# EAGLE schematic OPBS-Muscle (EAGLE 6.4)

## Sheet 1 of 7
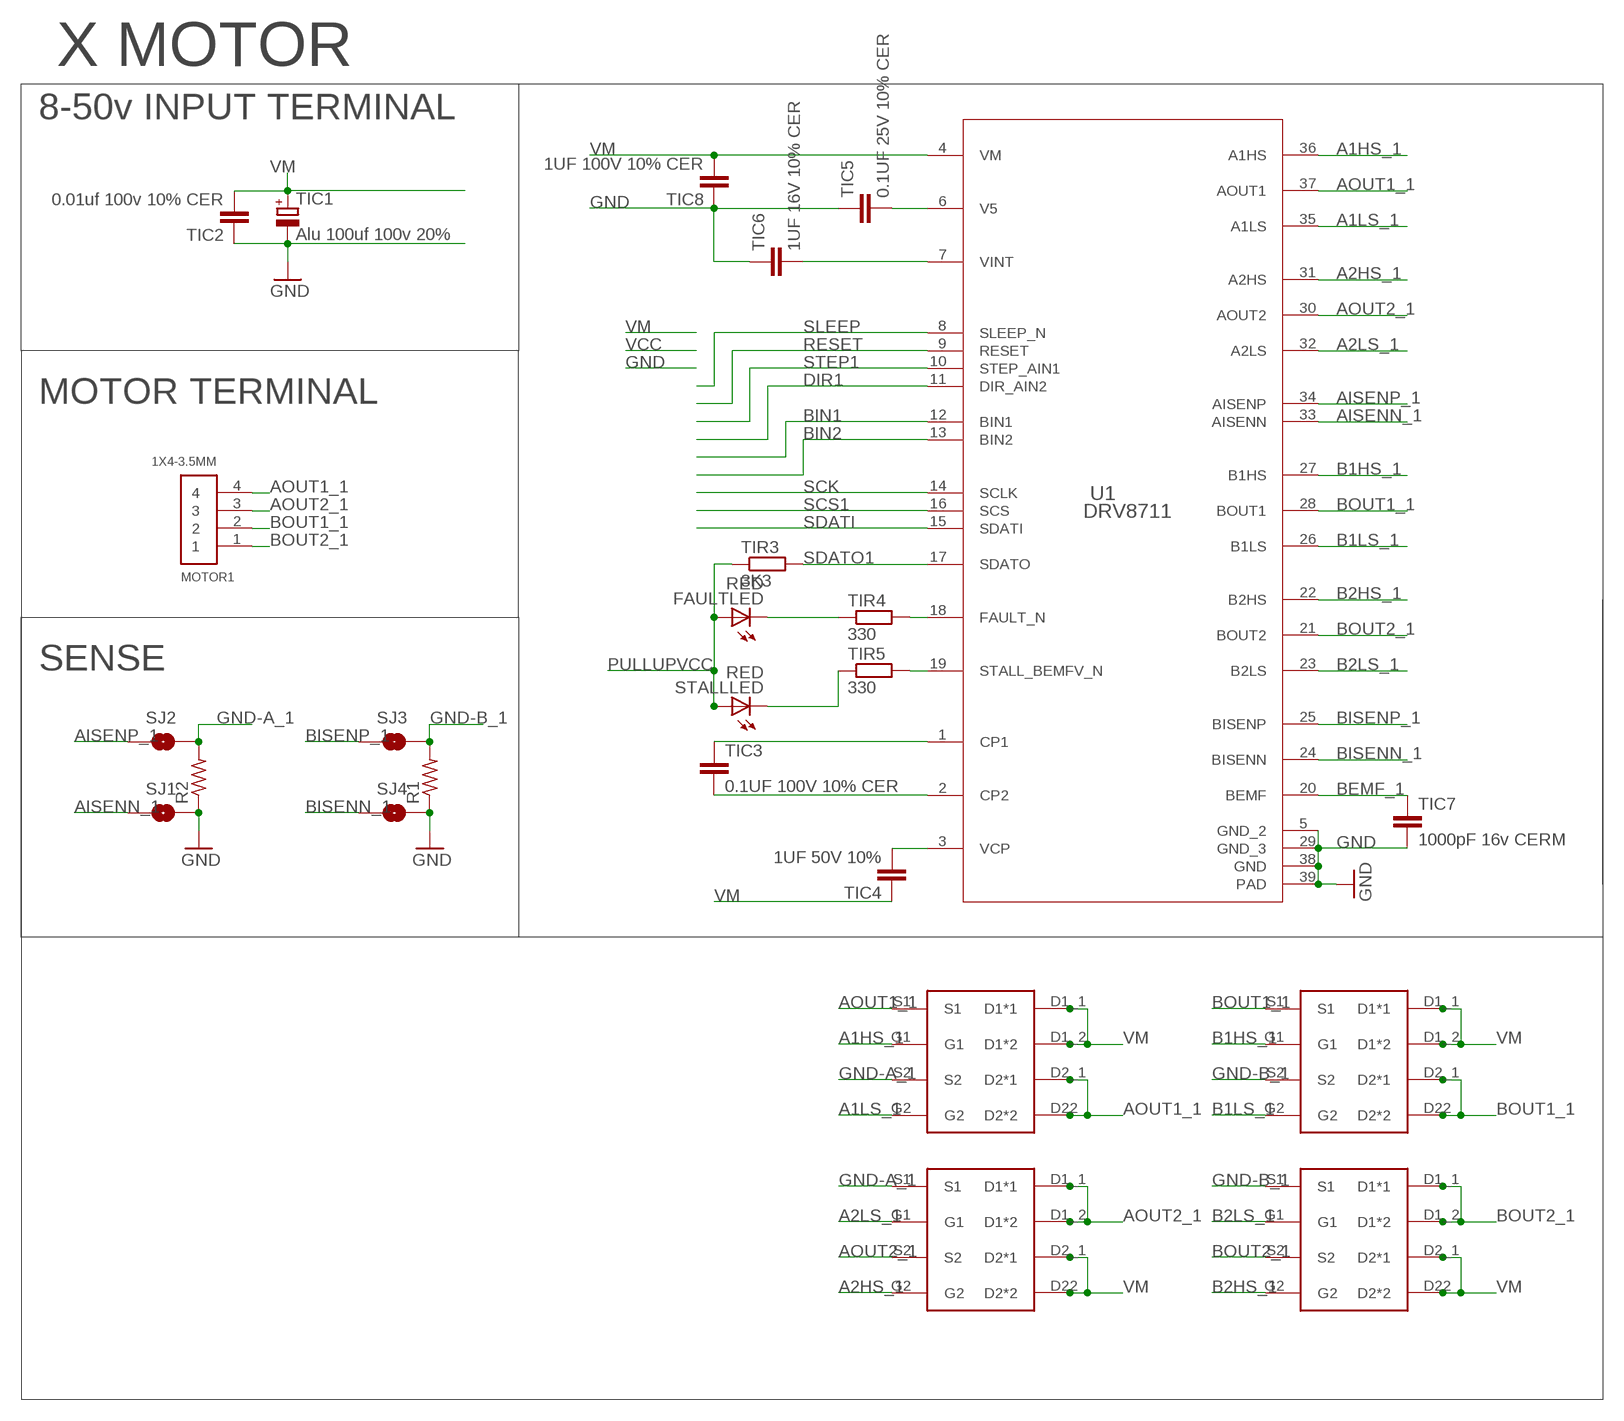
[diagram p0: schematic, sheet 1]

### Parts
FAULTLED  RED  LEDSMT1206  [1206]
MOTOR1  1X4-3.5MM  [1X04-3.5MM]
R1  R-US_R2512  [R2512]
R2  R-US_R2512  [R2512]
SJ1  SOLDERJUMPERTRACE  [SJ_2S-TRACE]
SJ2  SOLDERJUMPERTRACE  [SJ_2S-TRACE]
SJ3  SOLDERJUMPERTRACE  [SJ_2S-TRACE]
SJ4  SOLDERJUMPERTRACE  [SJ_2S-TRACE]
STALLLED  RED  LEDSMT1206  [1206]
TIC1  Alu 100uf 100v 20%  CPOL-EUE5-10.5  [E5-10,5]
TIC2  0.01uf 100v 10% CER  C-EUC0603K  [C0603K]
TIC3  0.1UF 100V 10% CER  C-EUC0603K  [C0603K]
TIC4  1UF 50V 10%  C-EUC0805K  [C0805K]
TIC5  0.1UF 25V 10% CER  C-EUC0603K  [C0603K]
TIC6  1UF 16V 10% CER  C-EUC0603K  [C0603K]
TIC7  1000pF 16v CERM  C-EUC0603K  [C0603K]
TIC8  1UF 100V 10% CER  C-EUC1206K  [C1206K]
TIR3  3K3  R-EU_R1206  [R1206]
TIR4  330  R-EU_R1206  [R1206]
TIR5  330  R-EU_R1206  [R1206]
U1  DRV8711  DRV8711DCPR  [DCP0038A_N]
U$1  CSD88537ND  [CSD88537ND]
U$2  CSD88537ND  [CSD88537ND]
U$3  CSD88537ND  [CSD88537ND]
U$4  CSD88537ND  [CSD88537ND]

### Nets
A1HS_1: U1.36(A1HS) U$1.G1
A1LS_1: U1.35(A1LS) U$1.G2
A2HS_1: U1.31(A2HS) U$3.G2
A2LS_1: U1.32(A2LS) U$3.G1
AISENN_1: SJ1.1 U1.33(AISENN)
AISENP_1: SJ2.1 U1.34(AISENP)
AOUT1_1: MOTOR1.4 U1.37(AOUT1) U$1.D2_1(D2*1) U$1.D22(D2*2) U$1.S1
AOUT2_1: MOTOR1.3 U1.30(AOUT2) U$3.D1_1(D1*1) U$3.D1_2(D1*2) U$3.S2
B1HS_1: U1.27(B1HS) U$2.G1
B1LS_1: U1.26(B1LS) U$2.G2
B2HS_1: U1.22(B2HS) U$4.G2
B2LS_1: U1.23(B2LS) U$4.G1
BEMF_1: TIC7.1 U1.20(BEMF)
BIN1: U1.12(BIN1)
BIN2: U1.13(BIN2)
BISENN_1: SJ4.1 U1.24(BISENN)
BISENP_1: SJ3.1 U1.25(BISENP)
BOUT1_1: MOTOR1.2 U1.28(BOUT1) U$2.D2_1(D2*1) U$2.D22(D2*2) U$2.S1
BOUT2_1: MOTOR1.1 U1.21(BOUT2) U$4.D1_1(D1*1) U$4.D1_2(D1*2) U$4.S2
CP1_1: TIC3.1 U1.1(CP1)
CP2_1: TIC3.2 U1.2(CP2)
DIR1: U1.11(DIR_AIN2) ; also sheet 6
FAULT_N1: TIR4.2 U1.18(FAULT_N)
FAULTLED: FAULTLED.C TIR4.1
GND: R1.1 R2.1 SJ1.2 SJ4.2 TIC1.- TIC2.1 TIC5.1 TIC6.1 TIC7.2 TIC8.1 U1.5(GND_2) U1.29(GND_3) U1.38(GND) U1.39(PAD) ; also sheet 2,3,4,5,6,7
GND-A_1: R2.2 SJ2.2 U$1.S2 U$3.S1
GND-B_1: R1.2 SJ3.2 U$2.S2 U$4.S1
PULLUPVCC: FAULTLED.A STALLLED.A TIR3.1 ; also sheet 2,3,4,6
RESET: U1.9(RESET) ; also sheet 2,3,4,6
SCK: U1.14(SCLK) ; also sheet 2,3,4,6
SCS1: U1.16(SCS) ; also sheet 6
SDATI: U1.15(SDATI) ; also sheet 2,3,4,6
SDATO1: TIR3.2 U1.17(SDATO) ; also sheet 2,3,4,6
SLEEP: U1.8(SLEEP_N) ; also sheet 2,3,4,6
STALL_N1: TIR5.2 U1.19(STALL_BEMFV_N)
STALLLED: STALLLED.C TIR5.1
STEP1: U1.10(STEP_AIN1) ; also sheet 6
V5_1: TIC5.2 U1.6(V5)
VCP1: TIC4.2 U1.3(VCP)
VINT1: TIC6.2 U1.7(VINT)
VM: TIC1.+ TIC2.2 TIC4.1 TIC8.2 U1.4(VM) U$1.D1_1(D1*1) U$1.D1_2(D1*2) U$2.D1_1(D1*1) U$2.D1_2(D1*2) U$3.D2_1(D2*1) U$3.D22(D2*2) U$4.D2_1(D2*1) U$4.D22(D2*2) ; also sheet 2,3,4,5,6,7

### Notes on the sheet
- X MOTOR
- 8-50v INPUT TERMINAL
- MOTOR TERMINAL
- SENSE

## Sheet 2 of 7
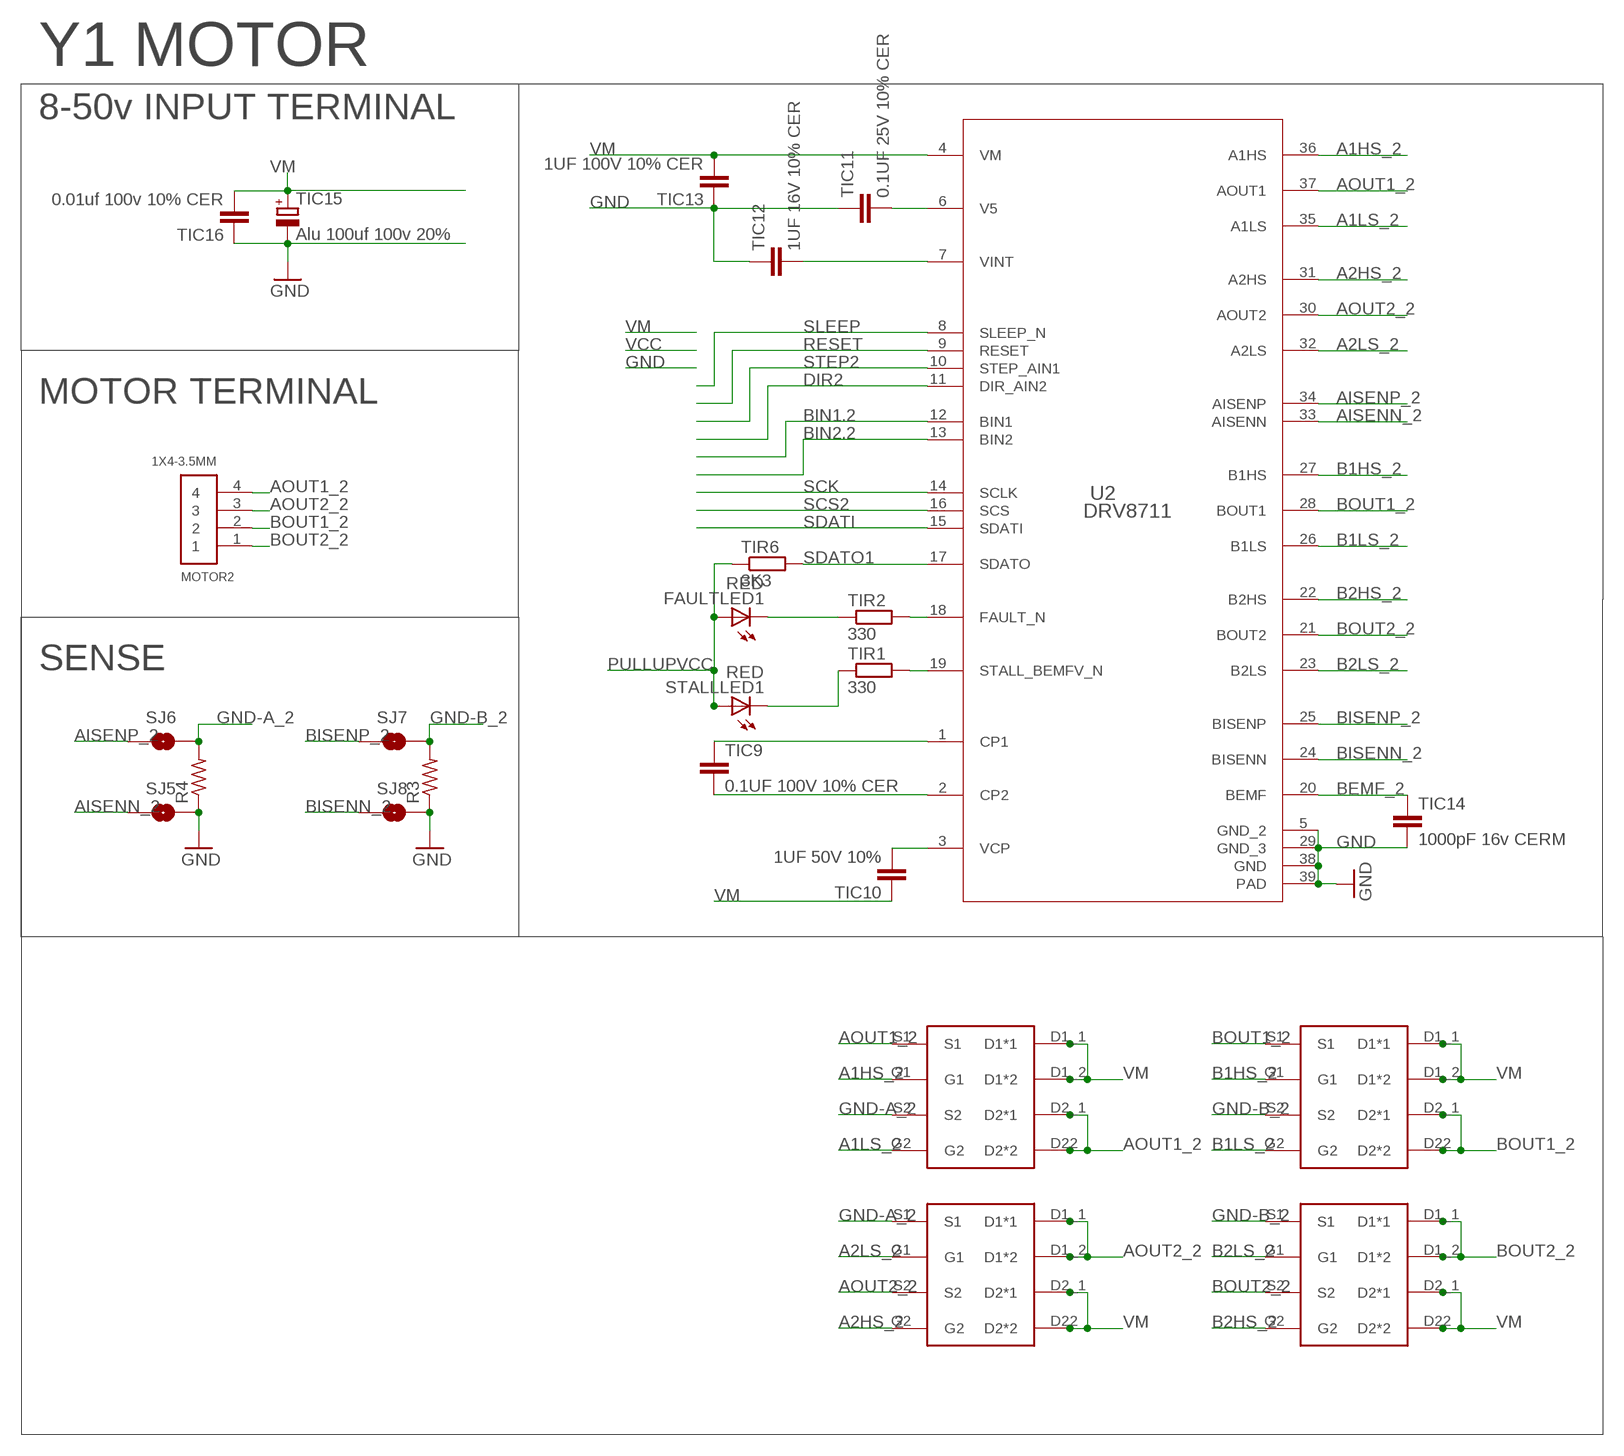
[diagram p1: schematic, sheet 2]

### Parts
FAULTLED1  RED  LEDSMT1206  [1206]
MOTOR2  1X4-3.5MM  [1X04-3.5MM]
R3  R-US_R2512  [R2512]
R4  R-US_R2512  [R2512]
SJ5  SOLDERJUMPERTRACE  [SJ_2S-TRACE]
SJ6  SOLDERJUMPERTRACE  [SJ_2S-TRACE]
SJ7  SOLDERJUMPERTRACE  [SJ_2S-TRACE]
SJ8  SOLDERJUMPERTRACE  [SJ_2S-TRACE]
STALLLED1  RED  LEDSMT1206  [1206]
TIC9  0.1UF 100V 10% CER  C-EUC0603K  [C0603K]
TIC10  1UF 50V 10%  C-EUC0805K  [C0805K]
TIC11  0.1UF 25V 10% CER  C-EUC0603K  [C0603K]
TIC12  1UF 16V 10% CER  C-EUC0603K  [C0603K]
TIC13  1UF 100V 10% CER  C-EUC1206K  [C1206K]
TIC14  1000pF 16v CERM  C-EUC0603K  [C0603K]
TIC15  Alu 100uf 100v 20%  CPOL-EUE5-10.5  [E5-10,5]
TIC16  0.01uf 100v 10% CER  C-EUC0603K  [C0603K]
TIR1  330  R-EU_R1206  [R1206]
TIR2  330  R-EU_R1206  [R1206]
TIR6  3K3  R-EU_R1206  [R1206]
U2  DRV8711  DRV8711DCPR  [DCP0038A_N]
U$5  CSD88537ND  [CSD88537ND]
U$6  CSD88537ND  [CSD88537ND]
U$7  CSD88537ND  [CSD88537ND]
U$8  CSD88537ND  [CSD88537ND]

### Nets
A1HS_2: U2.36(A1HS) U$5.G1
A1LS_2: U2.35(A1LS) U$5.G2
A2HS_2: U2.31(A2HS) U$7.G2
A2LS_2: U2.32(A2LS) U$7.G1
AISENN_2: SJ5.1 U2.33(AISENN)
AISENP_2: SJ6.1 U2.34(AISENP)
AOUT1_2: MOTOR2.4 U2.37(AOUT1) U$5.D2_1(D2*1) U$5.D22(D2*2) U$5.S1
AOUT2_2: MOTOR2.3 U2.30(AOUT2) U$7.D1_1(D1*1) U$7.D1_2(D1*2) U$7.S2
B1HS_2: U2.27(B1HS) U$6.G1
B1LS_2: U2.26(B1LS) U$6.G2
B2HS_2: U2.22(B2HS) U$8.G2
B2LS_2: U2.23(B2LS) U$8.G1
BEMF_2: TIC14.1 U2.20(BEMF)
BIN1.2: U2.12(BIN1)
BIN2.2: U2.13(BIN2)
BISENN_2: SJ8.1 U2.24(BISENN)
BISENP_2: SJ7.1 U2.25(BISENP)
BOUT1_2: MOTOR2.2 U2.28(BOUT1) U$6.D2_1(D2*1) U$6.D22(D2*2) U$6.S1
BOUT2_2: MOTOR2.1 U2.21(BOUT2) U$8.D1_1(D1*1) U$8.D1_2(D1*2) U$8.S2
CP1_2: TIC9.1 U2.1(CP1)
CP2_2: TIC9.2 U2.2(CP2)
DIR2: U2.11(DIR_AIN2) ; also sheet 6
FAULT_N2: TIR2.2 U2.18(FAULT_N)
FAULTLED2: FAULTLED1.C TIR2.1
GND: R3.1 R4.1 SJ5.2 SJ8.2 TIC11.1 TIC12.1 TIC13.1 TIC14.2 TIC15.- TIC16.1 U2.5(GND_2) U2.29(GND_3) U2.38(GND) U2.39(PAD) ; also sheet 1,3,4,5,6,7
GND-A_2: R4.2 SJ6.2 U$5.S2 U$7.S1
GND-B_2: R3.2 SJ7.2 U$6.S2 U$8.S1
PULLUPVCC: FAULTLED1.A STALLLED1.A TIR6.1 ; also sheet 1,3,4,6
RESET: U2.9(RESET) ; also sheet 1,3,4,6
SCK: U2.14(SCLK) ; also sheet 1,3,4,6
SCS2: U2.16(SCS) ; also sheet 6
SDATI: U2.15(SDATI) ; also sheet 1,3,4,6
SDATO1: TIR6.2 U2.17(SDATO) ; also sheet 1,3,4,6
SLEEP: U2.8(SLEEP_N) ; also sheet 1,3,4,6
STALL_N2: TIR1.2 U2.19(STALL_BEMFV_N)
STALLLED2: STALLLED1.C TIR1.1
STEP2: U2.10(STEP_AIN1) ; also sheet 6
V5_2: TIC11.2 U2.6(V5)
VCP2: TIC10.2 U2.3(VCP)
VINT2: TIC12.2 U2.7(VINT)
VM: TIC10.1 TIC13.2 TIC15.+ TIC16.2 U2.4(VM) U$5.D1_1(D1*1) U$5.D1_2(D1*2) U$6.D1_1(D1*1) U$6.D1_2(D1*2) U$7.D2_1(D2*1) U$7.D22(D2*2) U$8.D2_1(D2*1) U$8.D22(D2*2) ; also sheet 1,3,4,5,6,7

### Notes on the sheet
- Y1 MOTOR
- 8-50v INPUT TERMINAL
- MOTOR TERMINAL
- SENSE

## Sheet 3 of 7
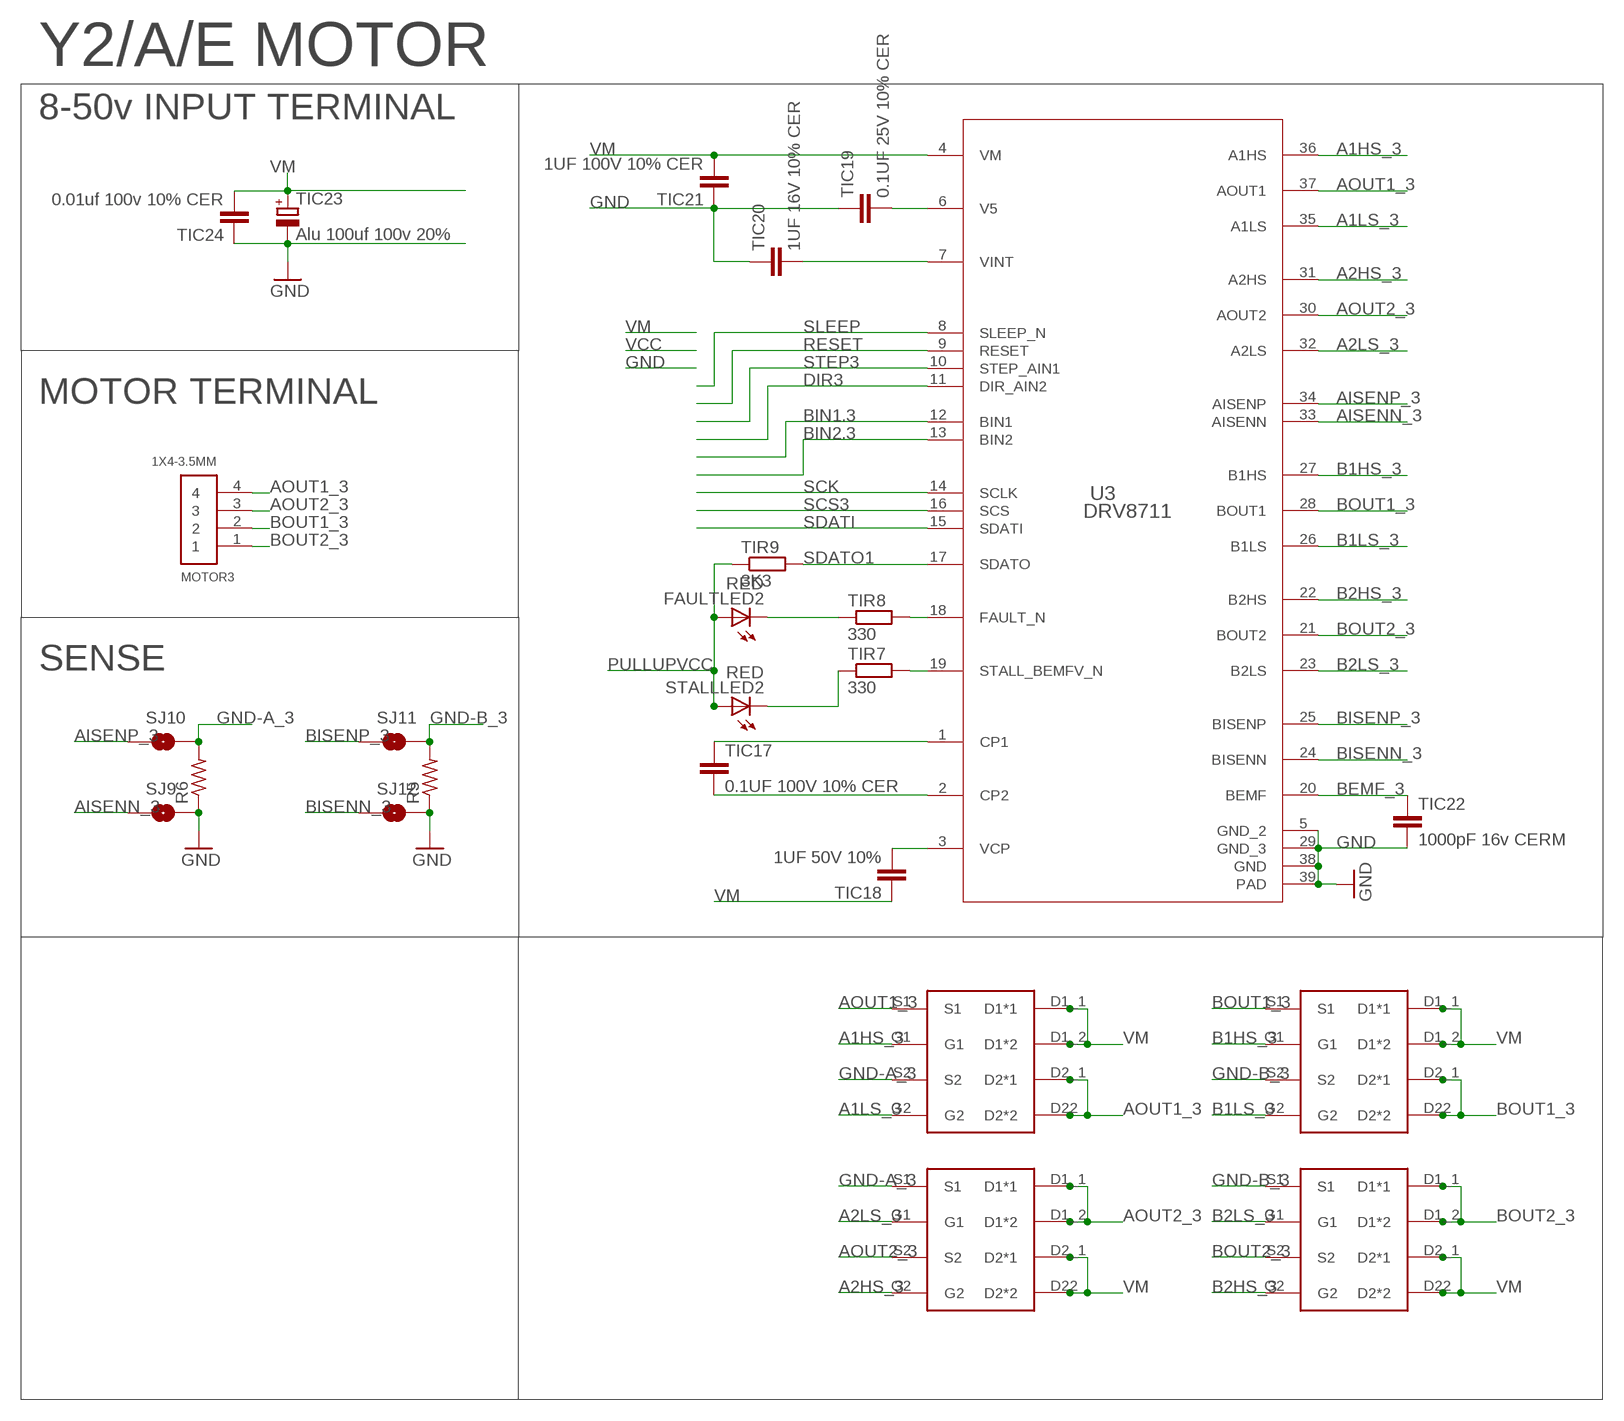
[diagram p2: schematic, sheet 3]

### Parts
FAULTLED2  RED  LEDSMT1206  [1206]
MOTOR3  1X4-3.5MM  [1X04-3.5MM]
R5  R-US_R2512  [R2512]
R6  R-US_R2512  [R2512]
SJ9  SOLDERJUMPERTRACE  [SJ_2S-TRACE]
SJ10  SOLDERJUMPERTRACE  [SJ_2S-TRACE]
SJ11  SOLDERJUMPERTRACE  [SJ_2S-TRACE]
SJ12  SOLDERJUMPERTRACE  [SJ_2S-TRACE]
STALLLED2  RED  LEDSMT1206  [1206]
TIC17  0.1UF 100V 10% CER  C-EUC0603K  [C0603K]
TIC18  1UF 50V 10%  C-EUC0805K  [C0805K]
TIC19  0.1UF 25V 10% CER  C-EUC0603K  [C0603K]
TIC20  1UF 16V 10% CER  C-EUC0603K  [C0603K]
TIC21  1UF 100V 10% CER  C-EUC1206K  [C1206K]
TIC22  1000pF 16v CERM  C-EUC0603K  [C0603K]
TIC23  Alu 100uf 100v 20%  CPOL-EUE5-10.5  [E5-10,5]
TIC24  0.01uf 100v 10% CER  C-EUC0603K  [C0603K]
TIR7  330  R-EU_R1206  [R1206]
TIR8  330  R-EU_R1206  [R1206]
TIR9  3K3  R-EU_R1206  [R1206]
U3  DRV8711  DRV8711DCPR  [DCP0038A_N]
U$9  CSD88537ND  [CSD88537ND]
U$10  CSD88537ND  [CSD88537ND]
U$11  CSD88537ND  [CSD88537ND]
U$12  CSD88537ND  [CSD88537ND]

### Nets
A1HS_3: U3.36(A1HS) U$9.G1
A1LS_3: U3.35(A1LS) U$9.G2
A2HS_3: U3.31(A2HS) U$11.G2
A2LS_3: U3.32(A2LS) U$11.G1
AISENN_3: SJ9.1 U3.33(AISENN)
AISENP_3: SJ10.1 U3.34(AISENP)
AOUT1_3: MOTOR3.4 U3.37(AOUT1) U$9.D2_1(D2*1) U$9.D22(D2*2) U$9.S1
AOUT2_3: MOTOR3.3 U3.30(AOUT2) U$11.D1_1(D1*1) U$11.D1_2(D1*2) U$11.S2
B1HS_3: U3.27(B1HS) U$10.G1
B1LS_3: U3.26(B1LS) U$10.G2
B2HS_3: U3.22(B2HS) U$12.G2
B2LS_3: U3.23(B2LS) U$12.G1
BEMF_3: TIC22.1 U3.20(BEMF)
BIN1.3: U3.12(BIN1)
BIN2.3: U3.13(BIN2)
BISENN_3: SJ12.1 U3.24(BISENN)
BISENP_3: SJ11.1 U3.25(BISENP)
BOUT1_3: MOTOR3.2 U3.28(BOUT1) U$10.D2_1(D2*1) U$10.D22(D2*2) U$10.S1
BOUT2_3: MOTOR3.1 U3.21(BOUT2) U$12.D1_1(D1*1) U$12.D1_2(D1*2) U$12.S2
CP1_3: TIC17.1 U3.1(CP1)
CP2_3: TIC17.2 U3.2(CP2)
DIR3: U3.11(DIR_AIN2) ; also sheet 6
FAULT_N3: TIR8.2 U3.18(FAULT_N)
FAULTLED3: FAULTLED2.C TIR8.1
GND: R5.1 R6.1 SJ9.2 SJ12.2 TIC19.1 TIC20.1 TIC21.1 TIC22.2 TIC23.- TIC24.1 U3.5(GND_2) U3.29(GND_3) U3.38(GND) U3.39(PAD) ; also sheet 1,2,4,5,6,7
GND-A_3: R6.2 SJ10.2 U$9.S2 U$11.S1
GND-B_3: R5.2 SJ11.2 U$10.S2 U$12.S1
PULLUPVCC: FAULTLED2.A STALLLED2.A TIR9.1 ; also sheet 1,2,4,6
RESET: U3.9(RESET) ; also sheet 1,2,4,6
SCK: U3.14(SCLK) ; also sheet 1,2,4,6
SCS3: U3.16(SCS) ; also sheet 6
SDATI: U3.15(SDATI) ; also sheet 1,2,4,6
SDATO1: TIR9.2 U3.17(SDATO) ; also sheet 1,2,4,6
SLEEP: U3.8(SLEEP_N) ; also sheet 1,2,4,6
STALL_N3: TIR7.2 U3.19(STALL_BEMFV_N)
STALLLED3: STALLLED2.C TIR7.1
STEP3: U3.10(STEP_AIN1) ; also sheet 6
V5_3: TIC19.2 U3.6(V5)
VCP3: TIC18.2 U3.3(VCP)
VINT3: TIC20.2 U3.7(VINT)
VM: TIC18.1 TIC21.2 TIC23.+ TIC24.2 U3.4(VM) U$9.D1_1(D1*1) U$9.D1_2(D1*2) U$10.D1_1(D1*1) U$10.D1_2(D1*2) U$11.D2_1(D2*1) U$11.D22(D2*2) U$12.D2_1(D2*1) U$12.D22(D2*2) ; also sheet 1,2,4,5,6,7

### Notes on the sheet
- Y2/A/E MOTOR
- 8-50v INPUT TERMINAL
- MOTOR TERMINAL
- SENSE

## Sheet 4 of 7
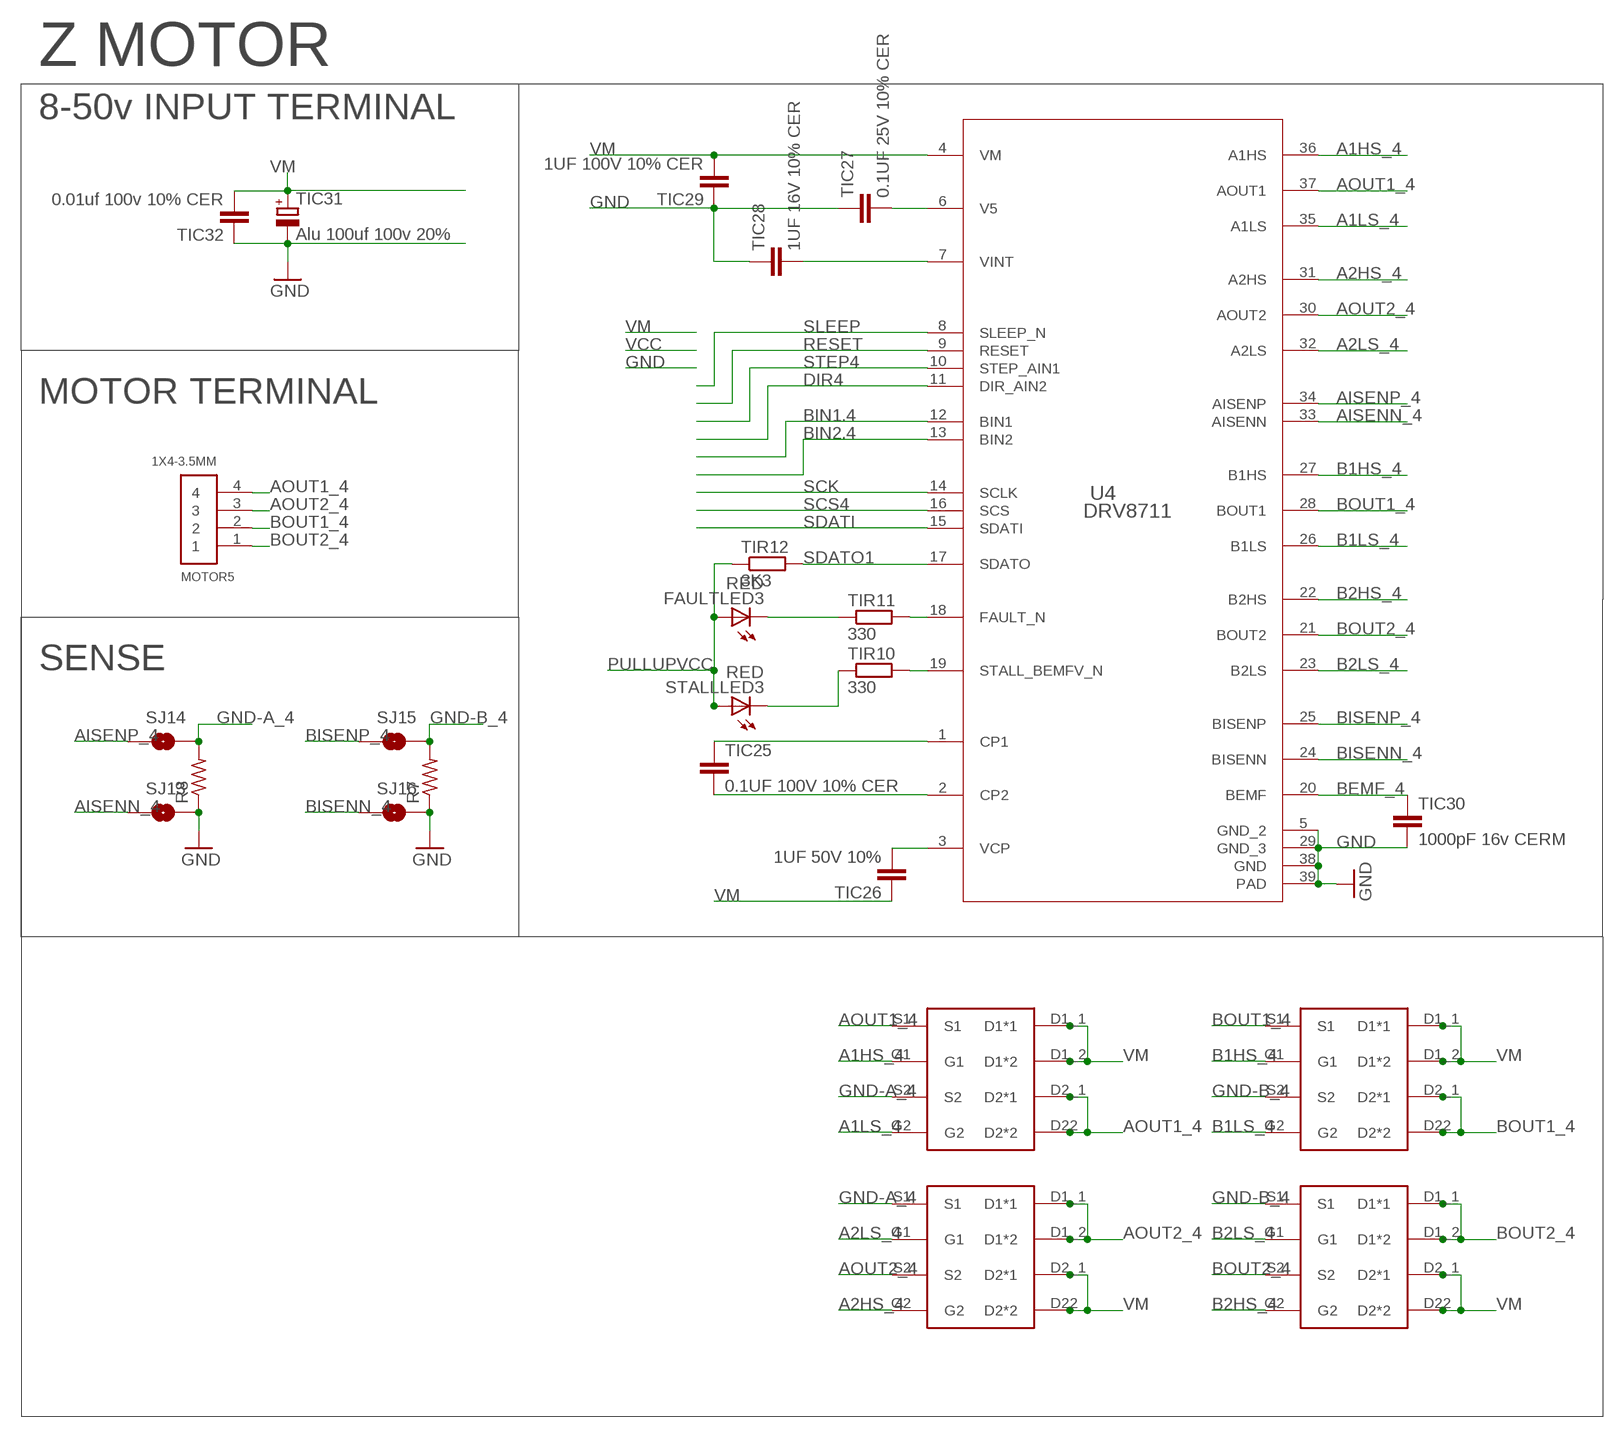
[diagram p3: schematic, sheet 4]

### Parts
FAULTLED3  RED  LEDSMT1206  [1206]
MOTOR5  1X4-3.5MM  [1X04-3.5MM]
R7  R-US_R2512  [R2512]
R8  R-US_R2512  [R2512]
SJ13  SOLDERJUMPERTRACE  [SJ_2S-TRACE]
SJ14  SOLDERJUMPERTRACE  [SJ_2S-TRACE]
SJ15  SOLDERJUMPERTRACE  [SJ_2S-TRACE]
SJ16  SOLDERJUMPERTRACE  [SJ_2S-TRACE]
STALLLED3  RED  LEDSMT1206  [1206]
TIC25  0.1UF 100V 10% CER  C-EUC0603K  [C0603K]
TIC26  1UF 50V 10%  C-EUC0805K  [C0805K]
TIC27  0.1UF 25V 10% CER  C-EUC0603K  [C0603K]
TIC28  1UF 16V 10% CER  C-EUC0603K  [C0603K]
TIC29  1UF 100V 10% CER  C-EUC1206K  [C1206K]
TIC30  1000pF 16v CERM  C-EUC0603K  [C0603K]
TIC31  Alu 100uf 100v 20%  CPOL-EUE5-10.5  [E5-10,5]
TIC32  0.01uf 100v 10% CER  C-EUC0603K  [C0603K]
TIR10  330  R-EU_R1206  [R1206]
TIR11  330  R-EU_R1206  [R1206]
TIR12  3K3  R-EU_R1206  [R1206]
U4  DRV8711  DRV8711DCPR  [DCP0038A_N]
U$13  CSD88537ND  [CSD88537ND]
U$14  CSD88537ND  [CSD88537ND]
U$15  CSD88537ND  [CSD88537ND]
U$16  CSD88537ND  [CSD88537ND]

### Nets
A1HS_4: U4.36(A1HS) U$13.G1
A1LS_4: U4.35(A1LS) U$13.G2
A2HS_4: U4.31(A2HS) U$15.G2
A2LS_4: U4.32(A2LS) U$15.G1
AISENN_4: SJ13.1 U4.33(AISENN)
AISENP_4: SJ14.1 U4.34(AISENP)
AOUT1_4: MOTOR5.4 U4.37(AOUT1) U$13.D2_1(D2*1) U$13.D22(D2*2) U$13.S1
AOUT2_4: MOTOR5.3 U4.30(AOUT2) U$15.D1_1(D1*1) U$15.D1_2(D1*2) U$15.S2
B1HS_4: U4.27(B1HS) U$14.G1
B1LS_4: U4.26(B1LS) U$14.G2
B2HS_4: U4.22(B2HS) U$16.G2
B2LS_4: U4.23(B2LS) U$16.G1
BEMF_4: TIC30.1 U4.20(BEMF)
BIN1.4: U4.12(BIN1)
BIN2.4: U4.13(BIN2)
BISENN_4: SJ16.1 U4.24(BISENN)
BISENP_4: SJ15.1 U4.25(BISENP)
BOUT1_4: MOTOR5.2 U4.28(BOUT1) U$14.D2_1(D2*1) U$14.D22(D2*2) U$14.S1
BOUT2_4: MOTOR5.1 U4.21(BOUT2) U$16.D1_1(D1*1) U$16.D1_2(D1*2) U$16.S2
CP1_4: TIC25.1 U4.1(CP1)
CP2_4: TIC25.2 U4.2(CP2)
DIR4: U4.11(DIR_AIN2) ; also sheet 6
FAULT_N4: TIR11.2 U4.18(FAULT_N)
FAULTLED4: FAULTLED3.C TIR11.1
GND: R7.1 R8.1 SJ13.2 SJ16.2 TIC27.1 TIC28.1 TIC29.1 TIC30.2 TIC31.- TIC32.1 U4.5(GND_2) U4.29(GND_3) U4.38(GND) U4.39(PAD) ; also sheet 1,2,3,5,6,7
GND-A_4: R8.2 SJ14.2 U$13.S2 U$15.S1
GND-B_4: R7.2 SJ15.2 U$14.S2 U$16.S1
PULLUPVCC: FAULTLED3.A STALLLED3.A TIR12.1 ; also sheet 1,2,3,6
RESET: U4.9(RESET) ; also sheet 1,2,3,6
SCK: U4.14(SCLK) ; also sheet 1,2,3,6
SCS4: U4.16(SCS) ; also sheet 6
SDATI: U4.15(SDATI) ; also sheet 1,2,3,6
SDATO1: TIR12.2 U4.17(SDATO) ; also sheet 1,2,3,6
SLEEP: U4.8(SLEEP_N) ; also sheet 1,2,3,6
STALL_N4: TIR10.2 U4.19(STALL_BEMFV_N)
STALLLED4: STALLLED3.C TIR10.1
STEP4: U4.10(STEP_AIN1) ; also sheet 6
V5_4: TIC27.2 U4.6(V5)
VCP4: TIC26.2 U4.3(VCP)
VINT4: TIC28.2 U4.7(VINT)
VM: TIC26.1 TIC29.2 TIC31.+ TIC32.2 U4.4(VM) U$13.D1_1(D1*1) U$13.D1_2(D1*2) U$14.D1_1(D1*1) U$14.D1_2(D1*2) U$15.D2_1(D2*1) U$15.D22(D2*2) U$16.D2_1(D2*1) U$16.D22(D2*2) ; also sheet 1,2,3,5,6,7

### Notes on the sheet
- Z MOTOR
- 8-50v INPUT TERMINAL
- MOTOR TERMINAL
- SENSE

## Sheet 5 of 7
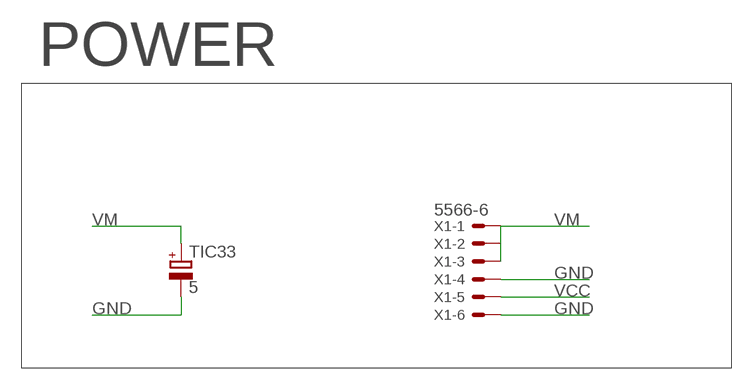
[diagram p4: schematic, sheet 5]

### Parts
TIC33  5  CPOL-EUE5-10.5  [E5-10,5]
X1  5566-6  [5566-6]

### Nets
GND: TIC33.- X1.4 X1.6 ; also sheet 1,2,3,4,6,7
VCC: X1.5 ; also sheet 1,2,3,4,6
VM: TIC33.+ X1.1 X1.2 X1.3 ; also sheet 1,2,3,4,6,7

### Notes on the sheet
- POWER

## Sheet 6 of 7
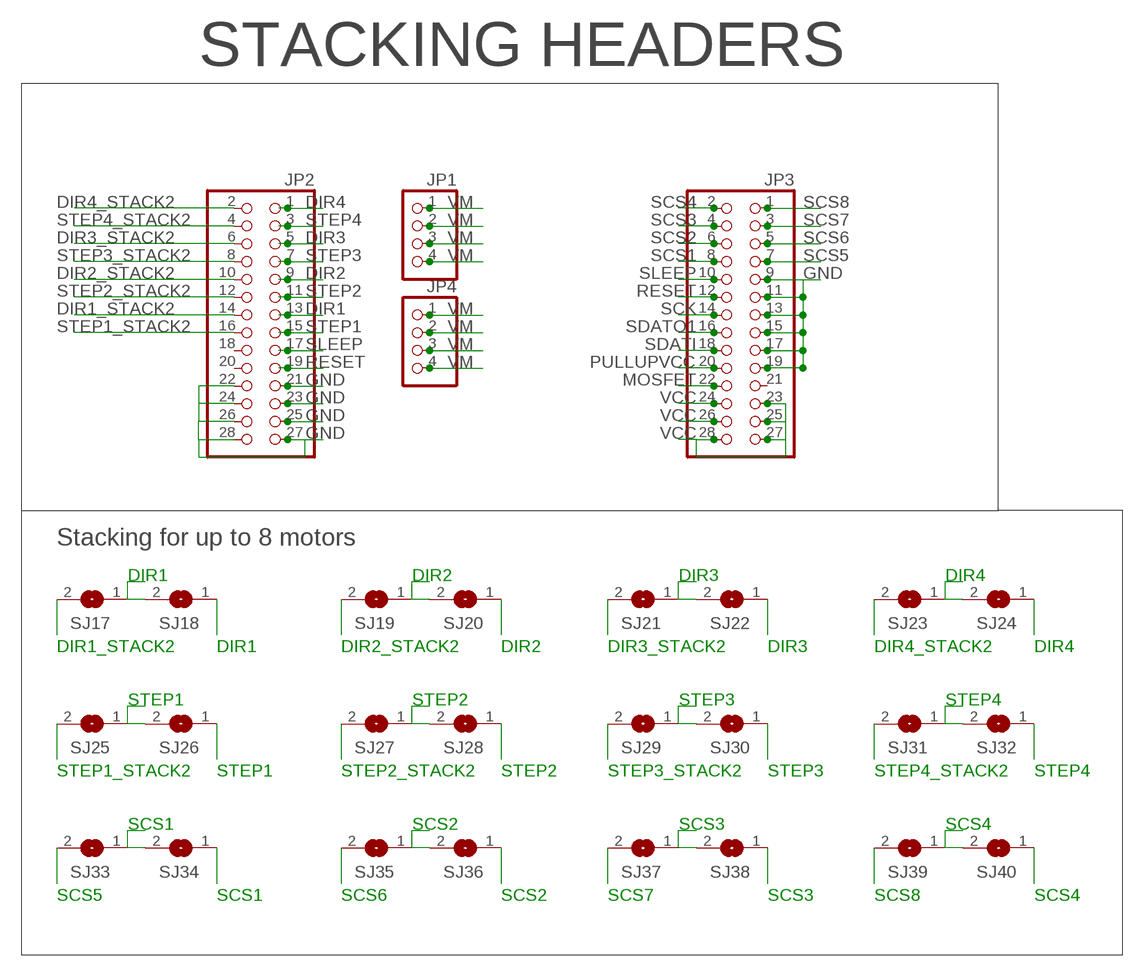
[diagram p5: schematic, sheet 6]

### Parts
JP1  PINHD-1X4  [1X04]
JP2  PINHD-2X14  [2X14]
JP3  PINHD-2X14  [2X14]
JP4  PINHD-1X4  [1X04]
SJ17  SJ  [SJ]
SJ18  SJ  [SJ]
SJ19  SJ  [SJ]
SJ20  SJ  [SJ]
SJ21  SJ  [SJ]
SJ22  SJ  [SJ]
SJ23  SJ  [SJ]
SJ24  SJ  [SJ]
SJ25  SJ  [SJ]
SJ26  SJ  [SJ]
SJ27  SJ  [SJ]
SJ28  SJ  [SJ]
SJ29  SJ  [SJ]
SJ30  SJ  [SJ]
SJ31  SJ  [SJ]
SJ32  SJ  [SJ]
SJ33  SJ  [SJ]
SJ34  SJ  [SJ]
SJ35  SJ  [SJ]
SJ36  SJ  [SJ]
SJ37  SJ  [SJ]
SJ38  SJ  [SJ]
SJ39  SJ  [SJ]
SJ40  SJ  [SJ]

### Nets
DIR1: JP2.13 SJ17.1 SJ18.1 SJ18.2 ; also sheet 1
DIR1_STACK2: JP2.14 SJ17.2
DIR2: JP2.9 SJ19.1 SJ20.1 SJ20.2 ; also sheet 2
DIR2_STACK2: JP2.10 SJ19.2
DIR3: JP2.5 SJ21.1 SJ22.1 SJ22.2 ; also sheet 3
DIR3_STACK2: JP2.6 SJ21.2
DIR4: JP2.1 SJ23.1 SJ24.1 SJ24.2 ; also sheet 4
DIR4_STACK2: JP2.2 SJ23.2
GND: JP2.21 JP2.22 JP2.23 JP2.24 JP2.25 JP2.26 JP2.27 JP2.28 JP3.9 JP3.11 JP3.13 JP3.15 JP3.17 JP3.19 ; also sheet 1,2,3,4,5,7
MOSFET: JP3.22 ; also sheet 7
PULLUPVCC: JP3.20 ; also sheet 1,2,3,4
RESET: JP2.19 JP3.12 ; also sheet 1,2,3,4
SCK: JP3.14 ; also sheet 1,2,3,4
SCS1: JP3.8 SJ33.1 SJ34.1 SJ34.2 ; also sheet 1
SCS2: JP3.6 SJ35.1 SJ36.1 SJ36.2 ; also sheet 2
SCS3: JP3.4 SJ37.1 SJ38.1 SJ38.2 ; also sheet 3
SCS4: JP3.2 SJ39.1 SJ40.1 SJ40.2 ; also sheet 4
SCS5: JP3.7 SJ33.2
SCS6: JP3.5 SJ35.2
SCS7: JP3.3 SJ37.2
SCS8: JP3.1 SJ39.2
SDATI: JP3.18 ; also sheet 1,2,3,4
SDATO1: JP3.16 ; also sheet 1,2,3,4
SLEEP: JP2.17 JP3.10 ; also sheet 1,2,3,4
STEP1: JP2.15 SJ25.1 SJ26.1 SJ26.2 ; also sheet 1
STEP1_STACK2: JP2.16 SJ25.2
STEP2: JP2.11 SJ27.1 SJ28.1 SJ28.2 ; also sheet 2
STEP2_STACK2: JP2.12 SJ27.2
STEP3: JP2.7 SJ29.1 SJ30.1 SJ30.2 ; also sheet 3
STEP3_STACK2: JP2.8 SJ29.2
STEP4: JP2.3 SJ31.1 SJ32.1 SJ32.2 ; also sheet 4
STEP4_STACK2: JP2.4 SJ31.2
VCC: JP3.23 JP3.24 JP3.25 JP3.26 JP3.27 JP3.28 ; also sheet 1,2,3,4,5
VM: JP1.1 JP1.2 JP1.3 JP1.4 JP4.1 JP4.2 JP4.3 JP4.4 ; also sheet 1,2,3,4,5,7
Unconnected: JP2.18 JP2.20 JP3.21

### Notes on the sheet
- STACKING HEADERS
- Stacking for up to 8 motors

## Sheet 7 of 7
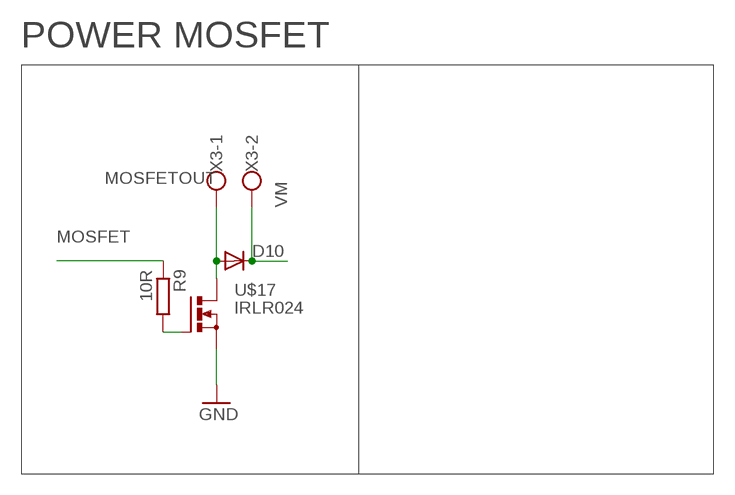
[diagram p6: schematic, sheet 7]

### Parts
D10  DIODESMA-ALT  [SMA-DIODE_ALT]
R9  10R  R-EU_M1206  [M1206]
U$17  IRLR024  [D-PAK_TO252AA]
X3  W237-102  [W237-102]

### Nets
GND: U$17.3(SOURCE) ; also sheet 1,2,3,4,5,6
MOSFET: R9.1 ; also sheet 6
MOSFETOUT: D10.A U$17.2(DRAIN) X3.1
N$8: R9.2 U$17.1(GATE)
VM: D10.C X3.2 ; also sheet 1,2,3,4,5,6

### Notes on the sheet
- POWER MOSFET

## Library data of the parts
D10 = SparkFun-DiscreteSemi:DIODE: Diode These are standard reverse protection diodes and small signal diodes. SMA package can handle up to about 1A. SOD-323 can handle about 200mA. What the SOD-323 package when ordering, there are some mfgs out there that are 5-pin packages.
FAULTLED FAULTLED1-FAULTLED3 STALLLED STALLLED1-STALLLED3 = led:LED: LED OSRAM: - CHIPLED LG R971, LG N971, LY N971, LG Q971, LY Q971, LO R971, LY R971 LH N974, LH R974 LS Q976, LO Q976, LY Q976 LO Q996 - Hyper CHIPLED LW Q18S LB Q993, LB Q99A, LB R99A - SideLED LS A670, LO A670, LY A670, LG A670, LP A670 LB A673, LV A673, LT A673, LW A673 LH A674 LY A675 LS A676, LA A676, LO A676, LY A676, LW A676 LS A679, LY A679, LG A679 - Hyper Micro SIDELED® LS Y876, LA Y876, LO Y876, LY Y876 LT Y87S - SmartLED LW L88C, LW L88S LB L89C, LB L89S, LG L890 LS L89K, LO L89K, LY L89K LS L896, LA L896, LO L896, LY L896 - TOPLED LS T670, LO T670, LY T670, LG T670, LP T670 LSG T670, LSP T670, LSY T670, LOP T670, LYG T670 LG T671, LOG T671, LSG T671 LB T673, LV T673, LT T673, LW T673 LH T674 LS T676, LA T676, LO T676, LY T676, LB T676, LH T676, LSB T676, LW T676 LB T67C, LV T67C, LT T67C, LS T67K, LO T67K, LY T67K, LW E67C LS E67B, LA E67B, LO E67B, LY E67B, LB E67C, LV E67C, LT E67C LW T67C LS T679, LY T679, LG T679 LS T770, LO T770, LY T770, LG T770, LP T770 LB T773, LV T773, LT T773, LW T773 LH T774 LS E675, LA E675, LY E675, LS T675 LS T776, LA T776, LO T776, LY T776, LB T776 LHGB T686 LT T68C, LB T68C - Hyper Mini TOPLED® LB M676 - Mini TOPLED Santana® LG M470 LS M47K, LO M47K, LY M47K Source: http://www.osram.convergy.de LUXEON: - LUMILED® LXK2-PW12-R00, LXK2-PW12-S00, LXK2-PW14-U00, LXK2-PW14-V00 LXK2-PM12-R00, LXK2-PM12-S00, LXK2-PM14-U00 LXK2-PE12-Q00, LXK2-PE12-R00, LXK2-PE12-S00, LXK2-PE14-T00, LXK2-PE14-U00 LXK2-PB12-K00, LXK2-PB12-L00, LXK2-PB12-M00, LXK2-PB14-N00, LXK2-PB14-P00, LXK2-PB14-Q00 LXK2-PR12-L00, LXK2-PR12-M00, LXK2-PR14-Q00, LXK2-PR14-R00 LXK2-PD12-Q00, LXK2-PD12-R00, LXK2-PD12-S00 LXK2-PH12-R00, LXK2-PH12-S00 LXK2-PL12-P00, LXK2-PL12-Q00, LXK2-PL12-R00 Source: www.luxeon.com KINGBRIGHT: KA-3528ASYC Source: www.kingbright.com
JP1 JP4 = pinhead:PINHD-1X4: PIN HEADER
JP2 JP3 = pinhead:PINHD-2X14: PIN HEADER
MOTOR1-MOTOR3 MOTOR5 = adafruit:1X4: 4-pin connector
R1-R8 = adafruit:R-US_: RESISTOR, American symbol
R9 = resistor:R-EU_: RESISTOR, European symbol
SJ1-SJ16 = SparkFun:SOLDERJUMPER: Solder Jumper Standard SMD solder jumper. Used to automate production. Two varients : Normally Open and Normally Closed are the same, but have different paste layers. NC will have a large amount of paste and should jumper during reflow.
SJ17-SJ40 = jumper:SJ: SMD solder JUMPER
TIC1 TIC15 TIC23 TIC31 TIC33 = resistor:CPOL-EU: POLARIZED CAPACITOR, European symbol
TIC2-TIC14 TIC16-TIC22 TIC24-TIC30 TIC32 = rcl:C-EU: CAPACITOR, European symbol
TIR1-TIR12 = rcl:R-EU_: RESISTOR, European symbol
U1-U4 = tidrv8711:DRV8711DCPR; ALTERNATEPARTNUMBER: DRV8711DCP; COMPTYPE: IC; MANUFACTURER: Texas Instruments; MOUNTTYPE: SMT; PACKAGEREFERENCE: DCP0038A; PARTNUMBER: DRV8711DCPR; PIN_COUNT: 39; REFDES: RefDes; ROHS: Y; TYPE: TYPE; VALUE: Value
U$1-U$16 = tidrv8711:CSD88537ND
U$17 = IRLR024:IRLR024
X1 = con-molex:5566-6: Mini FIT connector 6 pol Source: http://www.molex.com; MPN: 95566-61002; OC_FARNELL: unknown; OC_NEWARK: 22K8620
X3 = con-wago-500:W237-102: WAGO SCREW CLAMP; MPN: 237-102; OC_FARNELL: unknown; OC_NEWARK: 70K9898